# EAGLE schematic Aux Board V4 (EAGLE 9.2.0)
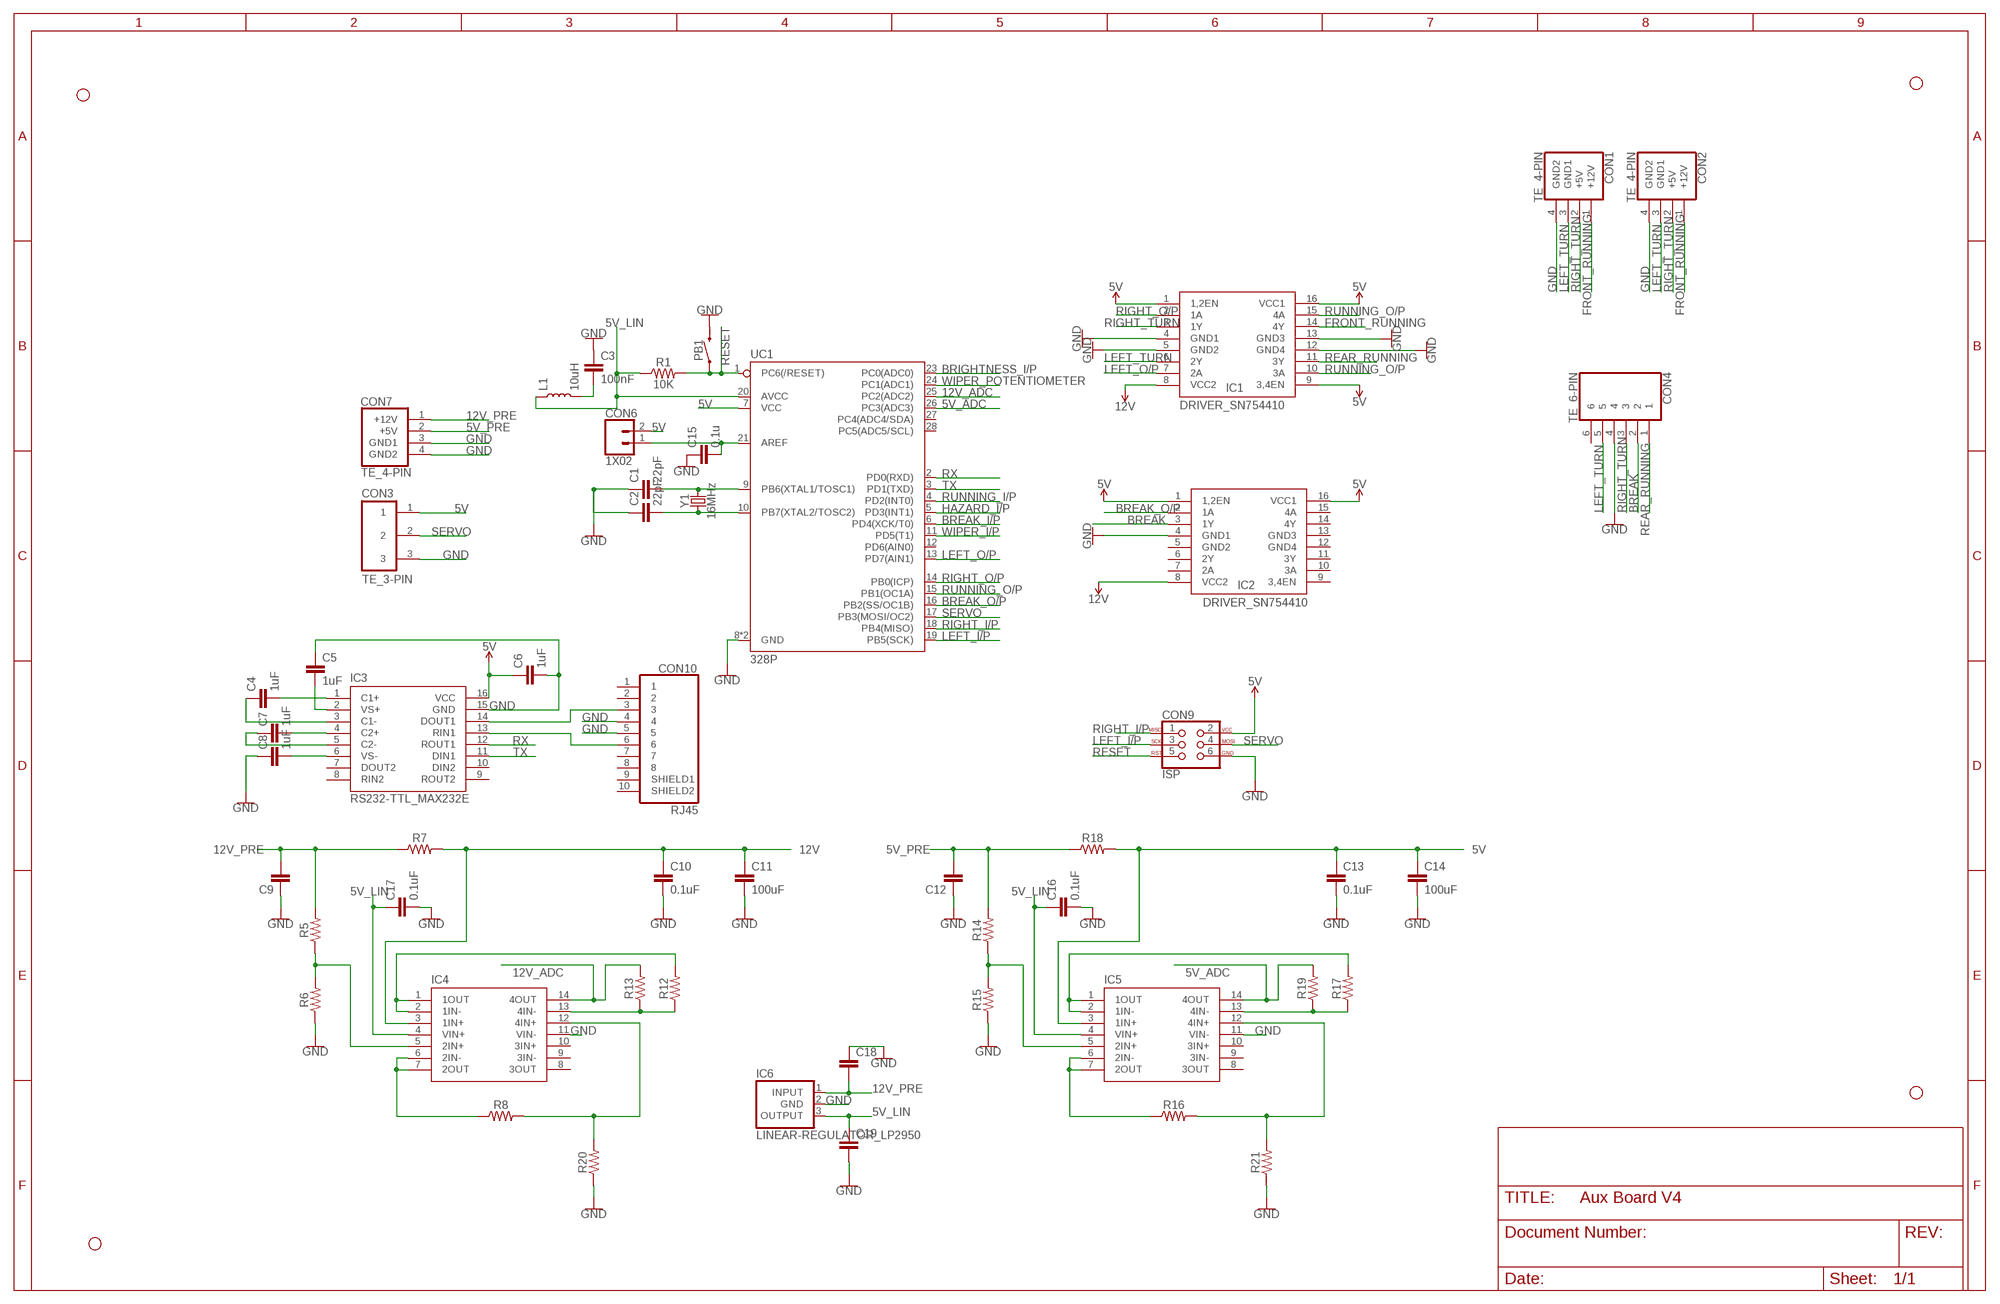
[diagram p0: schematic, sheet 1]

## Parts
C1  22pF  CAPACITOR_0805  [0805]
C2  22pF  CAPACITOR_0805  [0805]
C3  100nF  CAPACITOR_0805  [0805]
C4  1uF  CAPACITOR_0805  [0805]
C5  1uF  CAPACITOR_0805  [0805]
C6  1uF  CAPACITOR_0805  [0805]
C7  1uF  CAPACITOR_0805  [0805]
C8  1uF  CAPACITOR_0805  [0805]
C9  CAPACITOR_0805  [0805]
C10  0.1uF  CAPACITOR_0805  [0805]
C11  100uF  CAPACITOR_0805  [0805]
C12  CAPACITOR_0805  [0805]
C13  0.1uF  CAPACITOR_0805  [0805]
C14  100uF  CAPACITOR_0805  [0805]
C15  0.1u  CAPACITOR_0805  [0805]
C16  0.1uF  CAPACITOR_0805  [0805]
C17  0.1uF  CAPACITOR_0805  [0805]
C18  CAPACITOR_0805  [0805]
C19  CAPACITOR_0805  [0805]
CON1  TE_4-PIN  [TE_4-PIN]
CON2  TE_4-PIN  [TE_4-PIN]
CON3  TE_3-PIN  [TE_3-PIN]
CON4  TE_6-PIN  [TE_6-PIN]
CON6  1X02  [1X02]
CON7  TE_4-PIN  [TE_4-PIN]
CON9  ISP  [ISP_CONNECTOR]
CON10  RJ45  [RJ45]
H1  STAND-OFF  [STAND-OFF]
H2  STAND-OFF  [STAND-OFF]
H3  STAND-OFF  [STAND-OFF]
H4  STAND-OFF  [STAND-OFF]
IC1  DRIVER_SN754410  [DIP16]
IC2  DRIVER_SN754410  [DIP16]
IC3  RS232-TTL_MAX232E  [DIP16]
IC4  OP-AMP_QUAD  [DIP14]
IC5  OP-AMP_QUAD  [DIP14]
IC6  LINEAR-REGULATOR_LP2950  [TO92]
L1  10uH  INDUCTOR_0805  [0805]
PB1  PUSHBUTTON  [PUSHBUTTON]
R1  10K  RESISTOR_0805  [0805]
R5  RESISTOR_0805  [0805]
R6  RESISTOR_0805  [0805]
R7  RESISTOR_1210  [1210]
R8  RESISTOR_0805  [0805]
R12  RESISTOR_0805  [0805]
R13  RESISTOR_0805  [0805]
R14  RESISTOR_0805  [0805]
R15  RESISTOR_0805  [0805]
R16  RESISTOR_0805  [0805]
R17  RESISTOR_0805  [0805]
R18  RESISTOR_1210  [1210]
R19  RESISTOR_0805  [0805]
R20  RESISTOR_0805  [0805]
R21  RESISTOR_0805  [0805]
UC1  328P  ATMEGA328P_DIP28  [DIP28]
Y1  16MHz  CRYSTAL-16MHZPTH-HC49US  [HC49US]

## Nets
5V: C6.1 C13.1 C14.1 C15.2 CON3.1 CON6.1 CON6.2 CON9.2 IC1.1(1,2EN) IC1.9(3,4EN) IC1.16(VCC1) IC2.1(1,2EN) IC2.16(VCC1) IC3.16(VCC) IC5.3(1IN+) R18.2 UC1.7(VCC) UC1.21(AREF)
5V_ADC: IC5.14(4OUT) R19.2 UC1.26(PC3(ADC3))
5V_LIN: C16.1 C17.1 C19.1 IC4.4(VIN+) IC5.4(VIN+) IC6.3(OUTPUT) L1.1 R1.1 UC1.20(AVCC)
5V_PRE: C12.2 CON7.2(+5V) R14.2 R18.1
12V: C10.1 C11.1 IC1.8(VCC2) IC2.8(VCC2) IC4.3(1IN+) R7.2
12V_ADC: IC4.14(4OUT) R13.2 UC1.25(PC2(ADC2))
12V_PRE: C9.2 C18.2 CON7.1(+12V) IC6.1(INPUT) R5.2 R7.1
BREAK: CON4.2 IC2.3(1Y)
BREAK_I/P: UC1.6(PD4(XCK/T0))
BREAK_O/P: IC2.2(1A) UC1.16(PB2(SS/OC1B))
BRIGHTNESS_I/P: UC1.23(PC0(ADC0))
FRONT_RUNNING: CON1.1(+12V) CON2.1(+12V) IC1.14(4Y)
GND: C1.1 C2.1 C3.1 C5.1 C6.2 C8.1 C9.1 C10.2 C11.2 C12.1 C13.2 C14.2 C15.1 C16.2 C17.2 C18.1 C19.2 CON1.4(GND2) CON2.4(GND2) CON3.3 CON4.4 CON7.3(GND1) CON7.4(GND2) CON9.6 CON10.4 CON10.5 IC1.4(GND1) IC1.5(GND2) IC1.12(GND4) IC1.13(GND3) IC2.4(GND1) IC3.15(GND) IC4.11(VIN-) IC5.11(VIN-) IC6.2(GND) PB1.3 PB1.4 R6.1 R15.1 R20.1 R21.1 UC1.8(GND) UC1.22(GND)
HAZARD_I/P: UC1.5(PD3(INT1))
LEFT_I/P: CON9.3 UC1.19(PB5(SCK))
LEFT_O/P: IC1.7(2A) UC1.13(PD7(AIN1))
LEFT_TURN: CON1.3(GND1) CON2.3(GND1) CON4.5 IC1.6(2Y)
N$1: C4.2 IC3.1(C1+)
N$2: IC4.5(2IN+) R5.1 R6.2
N$3: C4.1 IC3.3(C1-)
N$4: C5.2 IC3.2(VS+)
N$5: IC4.6(2IN-) IC4.7(2OUT) R8.1
N$6: IC5.5(2IN+) R14.1 R15.2
N$7: IC4.1(1OUT) IC4.2(1IN-) R12.2
N$8: C1.2 UC1.9(PB6(XTAL1/TOSC1)) Y1.2
N$9: C2.2 UC1.10(PB7(XTAL2/TOSC2)) Y1.1
N$10: C7.2 IC3.4(C2+)
N$11: C7.1 IC3.5(C2-)
N$12: C8.2 IC3.6(VS-)
N$13: CON10.3 IC3.14(DOUT1)
N$14: CON10.6 IC3.13(RIN1)
N$15: IC4.13(4IN-) R12.1 R13.1
N$16: IC5.6(2IN-) IC5.7(2OUT) R16.1
N$17: IC5.1(1OUT) IC5.2(1IN-) R17.2
N$18: IC5.13(4IN-) R17.1 R19.1
N$19: C3.2 L1.2
N$20: IC4.12(4IN+) R8.2 R20.2
N$21: IC5.12(4IN+) R16.2 R21.2
REAR_RUNNING: CON4.1 IC1.11(3Y)
RESET: CON9.5 PB1.1 PB1.2 R1.2 UC1.1(PC6(/RESET))
RIGHT_I/P: CON9.1 UC1.18(PB4(MISO))
RIGHT_O/P: IC1.2(1A) UC1.14(PB0(ICP))
RIGHT_TURN: CON1.2(+5V) CON2.2(+5V) CON4.3 IC1.3(1Y)
RUNNING_I/P: UC1.4(PD2(INT0))
RUNNING_O/P: IC1.10(3A) IC1.15(4A) UC1.15(PB1(OC1A))
RX: IC3.12(ROUT1) UC1.2(PD0(RXD))
SERVO: CON3.2 CON9.4 UC1.17(PB3(MOSI/OC2))
TX: IC3.11(DIN1) UC1.3(PD1(TXD))
WIPER_I/P: UC1.11(PD5(T1))
WIPER_POTENTIOMETER: UC1.24(PC1(ADC1))
Unconnected: CON4.6 CON10.1 CON10.2 CON10.7 CON10.8 CON10.9(SHIELD1) CON10.10(SHIELD2) IC2.5(GND2) IC2.6(2Y) IC2.7(2A) IC2.9(3,4EN) IC2.10(3A) IC2.11(3Y) IC2.12(GND4) IC2.13(GND3) IC2.14(4Y) IC2.15(4A) IC3.7(DOUT2) IC3.8(RIN2) IC3.9(ROUT2) IC3.10(DIN2) IC4.8(3OUT) IC4.9(3IN-) IC4.10(3IN+) IC5.8(3OUT) IC5.9(3IN-) IC5.10(3IN+) UC1.12(PD6(AIN0)) UC1.27(PC4(ADC4/SDA)) UC1.28(PC5(ADC5/SCL))

## Library data of the parts
C1-C19 = EcoCar-Passives:CAPACITOR_0805
CON1 CON2 CON7 = EcoCar-Connectors:TE_4-PIN: 4 Pin TE Mini-Universal MATE-N-LOK - Use for 12V and 5V connections Part Number: 1-770968-0 Digikey Part Number: A32474-ND Matching Plug: A25571-ND Matching Crimps: A100828CT-ND
CON3 = EcoCar-Connectors:TE_3-PIN: 3 Pin TE Mini-Universal MATE-N-LOK Part Number: 1-770967-0 Digikey Part Number: A32473-ND Matching Plug: A25588-ND Matching Crimps: A100828CT-ND
CON4 = EcoCar-Connectors:TE_6-PIN: 6 Pin TE Mini-Universal MATE-N-LOK Part Number: 1-770969-0 Digikey Part Number: A32475-ND Matching Plug: A97674-ND Matching Crimps: A100828CT-ND
CON6 = EcoCar-Connectors-2.54mm:1X02: 2.54mm (0.1") Header
CON9 = EcoCar-Microcontrollers:ISP: ISP Header Use for programming microcontrollers such as the 328P
CON10 = EcoCar-Connectors:RJ45: RJ45 Connector - Use for signals and low power connections Unshielded Part Number: RJHSE-5080 Unshielded Digikey Part Number: RJHSE-5080-ND Shielded Part Number: RJHSE5E80 Shielded Digikey Part Number: RJHSE5E80-ND
H1-H4 = EcoCar-Miscellaneous:STAND-OFF: Stand Off Drill holes for mechanically mounting via screws, standoffs, etc. Note: Use the keepout ring to avoid running the screw head into surrounding components. Variant Overviews STAND-OFF - Mechanical footprint for a #4 phillips button head screw. STAND-OFF-TIGHT - Mechanical footprint for a #4 phillips button head screw, Example SparkFun Products Screw - Phillips Head (1/4", 4-40, 10 pack) <https://www.sparkfun.com/products/10453> (PRT-10453) Screw - Phillips Head (1/2", 4-40, 10 pack) <https://www.sparkfun.com/products/10452> (PRT-10452) Screw - Phillips Head (3/4", 4-40, 10 pack) <https://www.sparkfun.com/products/10451> (PRT-10451) Screw - Phillips Head (1", 4-40, 10 pack) <https://www.sparkfun.com/products/10450> (PRT-10450)
IC1 IC2 = EcoCar-Integrated-Circuits:DRIVER_SN754410: SN754410 Quadruple Half-H Driver Manufacturer: Texas Instruments Part Number: SN754410NE Digikey Part Number: 296-9911-5-ND
IC3 = EcoCar-Integrated-Circuits:RS232-TTL_MAX232E: Dual 5V TTL to RS-232 Converter Manufacturer: Texas Instruments Part Number: MAX232EIN Digikey Part Number: 296-27963-5-ND
IC4 IC5 = EcoCar-Integrated-Circuits:OP-AMP_QUAD: Quad Channel Op-Amp (Generic) Example Part: Manufacturer: Texas Instruments Part Number: TLV274IN Digikey Part Number: 296-14379-5-ND
IC6 = EcoCar-Integrated-Circuits:LINEAR-REGULATOR_LP2950: 5V Linear Regulator Manufacturer: Texas Instruments Part Number: LP2950-50LPRE3 Digikey Part Number: 296-20933-1-ND
L1 = EcoCar-Passives:INDUCTOR_0805
PB1 = EcoCar-Electromechanical:PUSHBUTTON: Pushbutton Manufacturer: TE Connectivity ALCOSWITCH Switches Part Number: 1825910-6 Digikey Part Number: 450-1650-ND
R1 R5 R6 R8 R12-R17 R19-R21 = EcoCar-Passives:RESISTOR_0805
R7 R18 = EcoCar-Passives:RESISTOR_1210
UC1 = EcoCar-Microcontrollers:ATMEGA328P_DIP28: ATmega328P Manufacturer: Microchip Part Number: ATMEGA328P-PU Digikey Part Number: ATMEGA328P-PU-ND; PROD_ID: IC-09136
Y1 = EcoCar-Microcontrollers:CRYSTAL-16MHZ: 16MHz Crystal Oscillator Manufacturer: TXC Part Number: 9B-16.000MBBK-B Digikey Part Number: 887-2015-ND; PROD_ID: XTAL-08181; SF_ID: COM-00536